# Altium schematic sheet ACCESSORY.SchDoc
size A; Organization: Altium Limited; Address1: L3, 12a Rodborough Rd; Address2: Frenchs Forest; Address3: NSW; Address4: Australia 2086
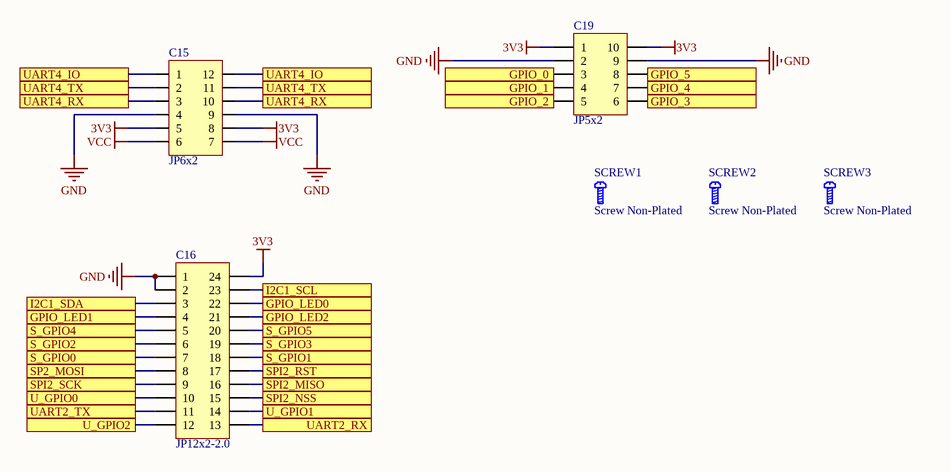
[diagram p0: ACCESSORY.SchDoc]

## Parts
C15  JP6x2  [JP6-D2T]
C16  JP12x2-2.0  [J12-D2T]
C19  JP5x2  [JP5-D2T]
SCREW1  Screw Non-Plated  [SCREW_NON-PLATED_2MM]
SCREW2  Screw Non-Plated  [SCREW_NON-PLATED_2MM]
SCREW3  Screw Non-Plated  [SCREW_NON-PLATED_2MM]

## Ports
GPIO_0, GPIO_1, GPIO_2, GPIO_3, GPIO_4, GPIO_5, GPIO_LED0, GPIO_LED1, GPIO_LED2, I2C1_SCL, I2C1_SDA, S_GPIO0, S_GPIO1, S_GPIO2, S_GPIO3, S_GPIO4, S_GPIO5, SP2_MOSI, SPI2_MISO, SPI2_NSS, SPI2_RST, SPI2_SCK, U_GPIO0, U_GPIO1, U_GPIO2, UART2_RX, UART2_TX, UART4_IO, UART4_RX, UART4_TX

## Nets
3V3: C15.5 C15.8 C16.24 C19.1 C19.10
GND: C15.4 C15.9 C16.1 C16.2 C19.2 C19.9
VCC: C15.6 C15.7
GPIO_0: C19.3 ; port GPIO_0
GPIO_1: C19.4 ; port GPIO_1
GPIO_2: C19.5 ; port GPIO_2
GPIO_3: C19.6 ; port GPIO_3
GPIO_4: C19.7 ; port GPIO_4
GPIO_5: C19.8 ; port GPIO_5
GPIO_LED0: C16.22 ; port GPIO_LED0
GPIO_LED1: C16.4 ; port GPIO_LED1
GPIO_LED2: C16.21 ; port GPIO_LED2
I2C1_SCL: C16.23 ; port I2C1_SCL
I2C1_SDA: C16.3 ; port I2C1_SDA
S_GPIO0: C16.7 ; port S_GPIO0
S_GPIO1: C16.18 ; port S_GPIO1
S_GPIO2: C16.6 ; port S_GPIO2
S_GPIO3: C16.19 ; port S_GPIO3
S_GPIO4: C16.5 ; port S_GPIO4
S_GPIO5: C16.20 ; port S_GPIO5
SP2_MOSI: C16.8 ; port SP2_MOSI
SPI2_MISO: C16.16 ; port SPI2_MISO
SPI2_NSS: C16.15 ; port SPI2_NSS
SPI2_RST: C16.17 ; port SPI2_RST
SPI2_SCK: C16.9 ; port SPI2_SCK
U_GPIO0: C16.10 ; port U_GPIO0
U_GPIO1: C16.14 ; port U_GPIO1
U_GPIO2: C16.12 ; port U_GPIO2
UART2_RX: C16.13 ; port UART2_RX
UART2_TX: C16.11 ; port UART2_TX
UART4_IO: C15.1 C15.12 ; port UART4_IO
UART4_RX: C15.3 C15.10 ; port UART4_RX
UART4_TX: C15.2 C15.11 ; port UART4_TX

## Notes on the sheet
- Title
- Size:
- Date:
- A
- Number:
- Time:
- Revision:
- Sheet
- of
- File:

## Library data of the parts
C15 = JP6x2: WR-PHD 2.54 mm Dual Socket Header; Manufacturer: W¨¹rth Elektronik eiSos GmbH; partNo: 61301221821; ComponentLink1 Description: Manufacturer; ComponentLink2 Description: Datasheet; NoPins: 12; Created Date: 29 March 2013; ComponentLink1URL: http://www.we-online.com; ComponentLink2URL: http://katalog.we-online.de/em/datasheet/6130xx21821.pdf; Created by: Karrer Zheng
C16 = JP12x2-2.0: WR-PHD 2.00 mm Dual Pin Header; Manufacturer: W¨¹rth Elektronik eiSos GmbH; partNo: 62002421121; ComponentLink1 Description: Manufacturer; ComponentLink2 Description: Datasheet; NoPins: 24; System: Connector; Created Date: 2 April 2013; ComponentLink1URL: http://www.we-online.com; ComponentLink2URL: http://katalog.we-online.de/em/datasheet/6200xx21121.pdf; Created by: Karrer Zheng
C19 = JP5x2: WR-PHD 2.54 mm Dual Socket Header; Manufacturer: W¨¹rth Elektronik eiSos GmbH; partNo: 61301021821; ComponentLink1 Description: Manufacturer; ComponentLink2 Description: Datasheet; NoPins: 10; Created Date: 29 March 2013; ComponentLink1URL: http://www.we-online.com; ComponentLink2URL: http://katalog.we-online.de/em/datasheet/6130xx21821.pdf; Created by: Karrer Zheng
SCREW1-SCREW3 = SCREW_NON-PLATED